# Altium project Control_unit-RM.PrjPcb
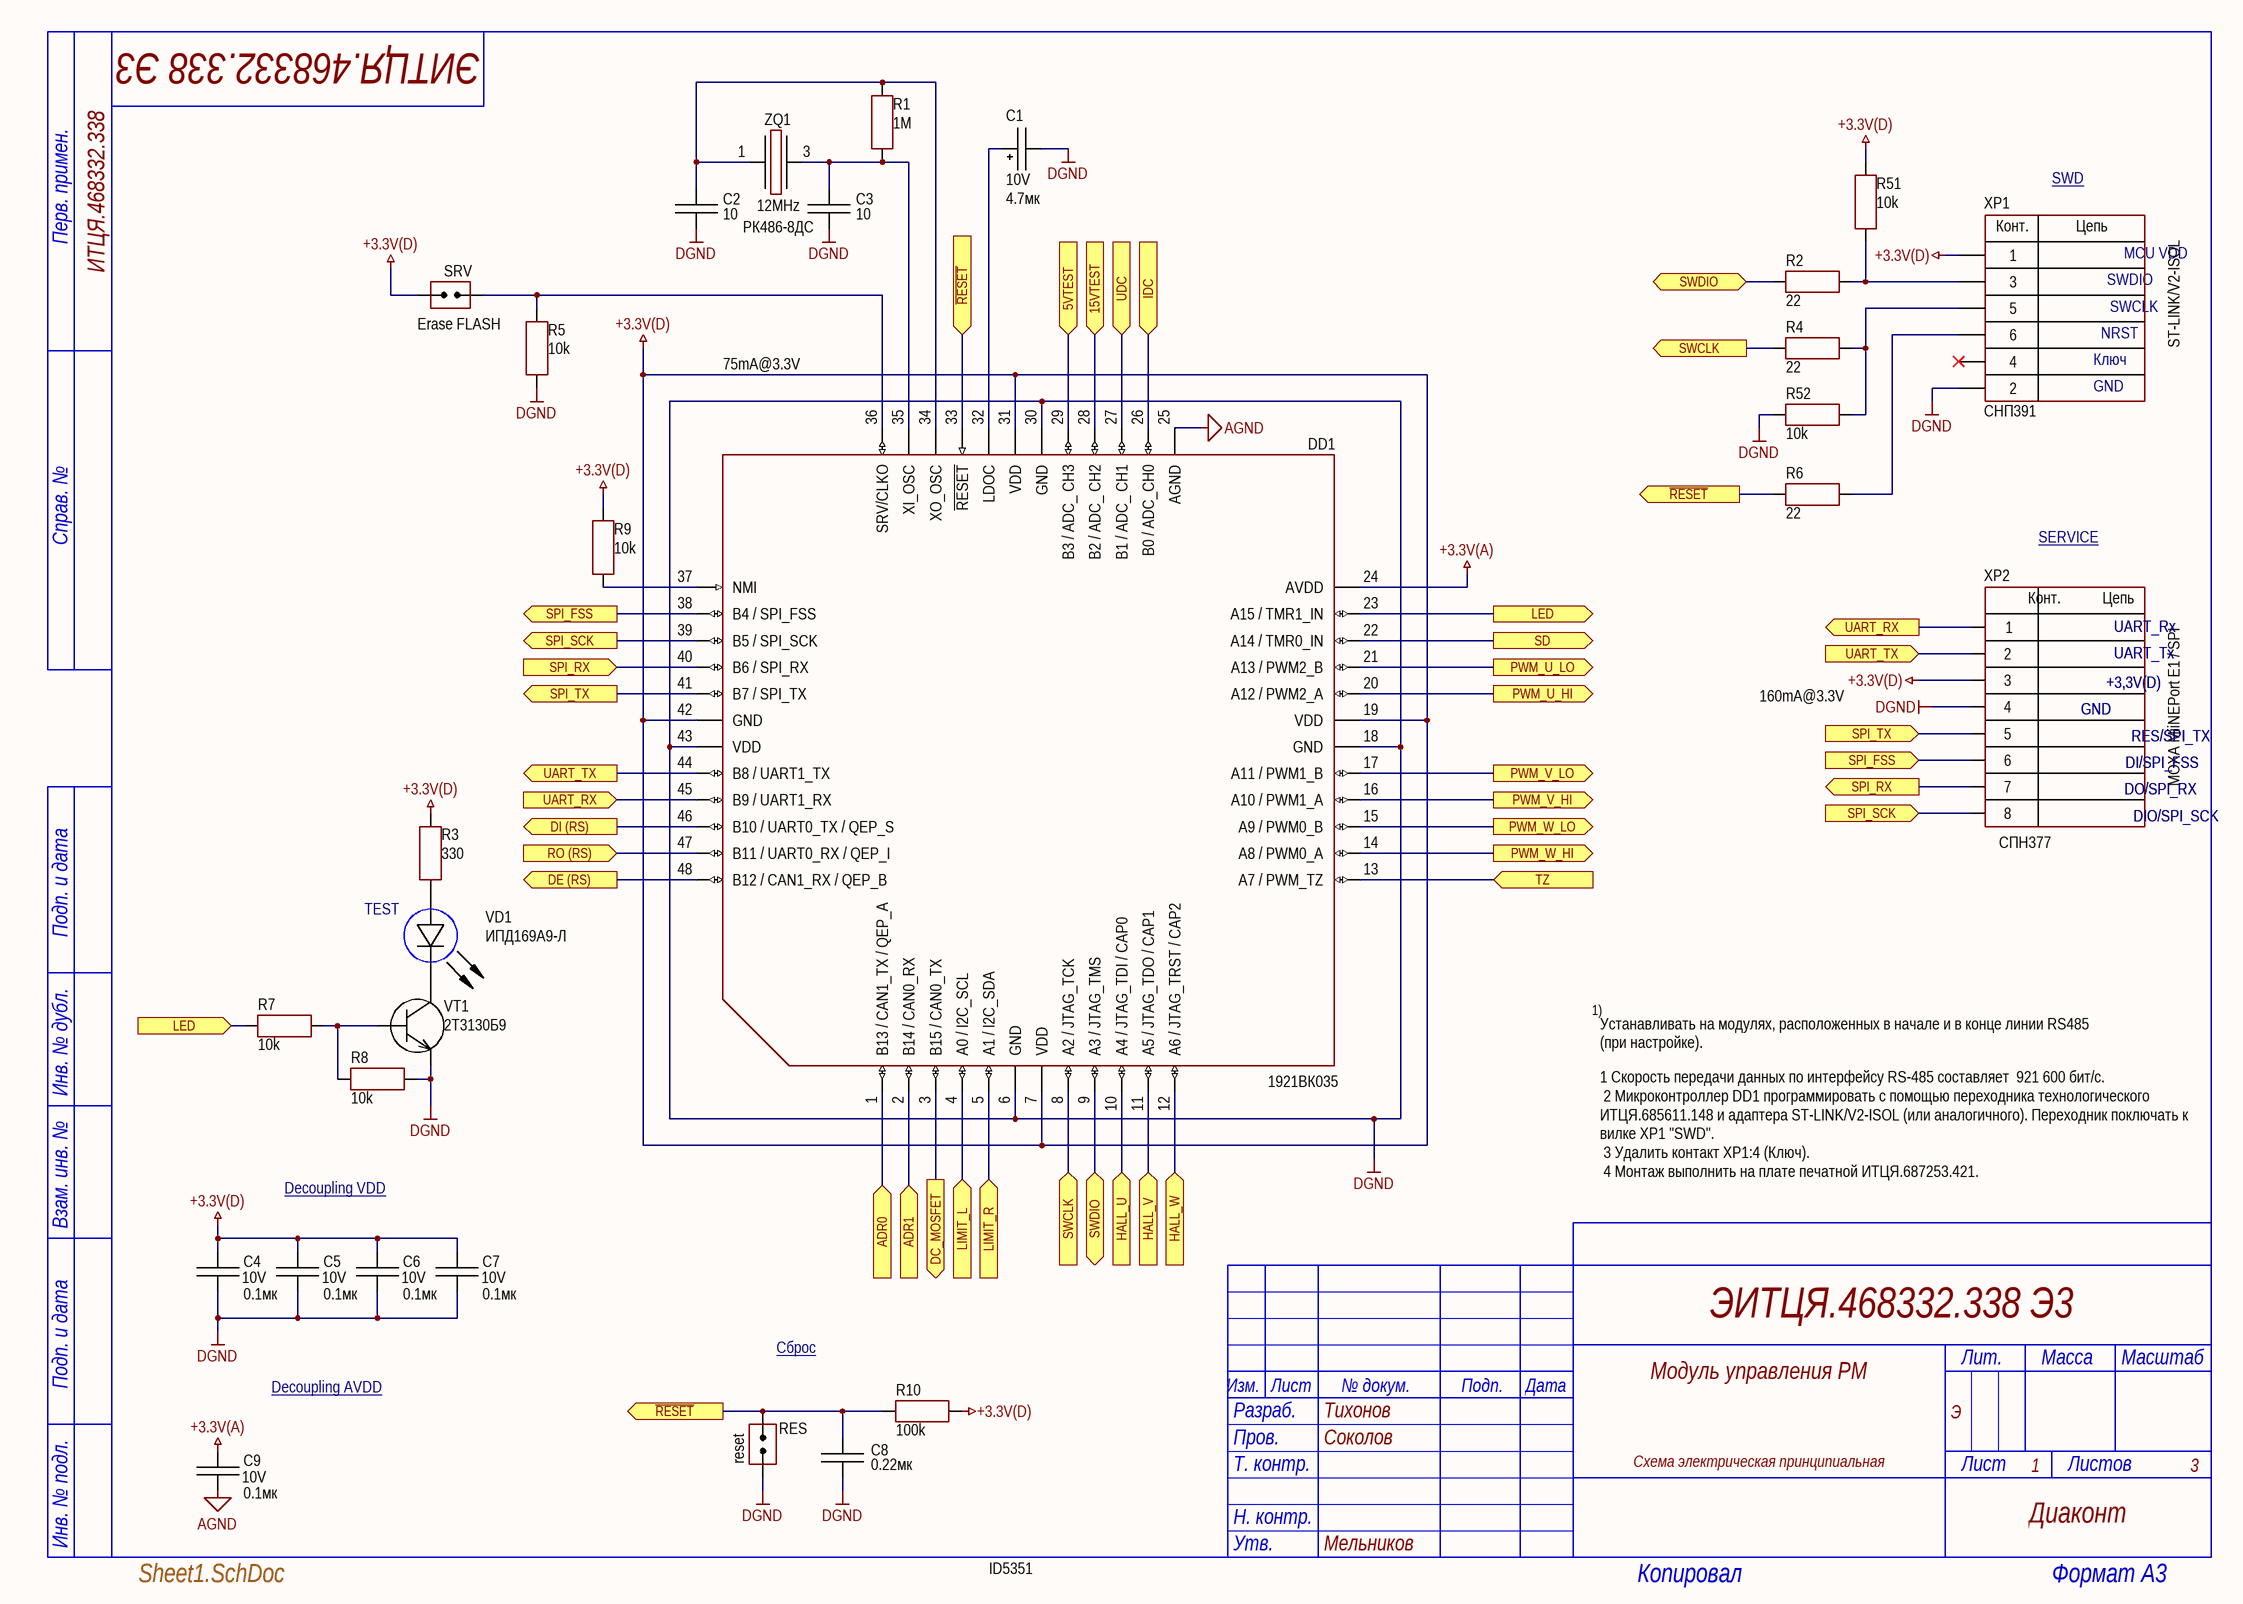
[diagram p0: Sheet1.SchDoc]
3 sheets, 113 parts. Net scope: flat (ports and power ports of the same name join across sheets).
Board file: PCB_control_unit.PcbDoc
Sheets:
  Sheet1.SchDoc
  Sheet2.SchDoc
  Sheet3.SchDoc

## Sheet Sheet1.SchDoc
size 420 x 297 mm; Language: en; ResponsibleDept: DED; DocumentStatus: Released; DecimalNumber: {DecimalNumber}; ApprovedBy: Мельников; CheckedBy: Соколов; CompanyName: Диаконт; DrawnBy: Тихонов; DocumentNumber: ЭИТЦЯ.468332.338 Э3; SheetNumber: 1; SheetTotal: 3; Title0: Модуль управления РМ; DocumentType: Схема электрическая принципиальная; Liter: Э; PageSetup: Record=PageOptions|CenterHorizontal=True|CenterVertical=True|PrintScale=0.96|XCorrection=1.00|YCorrection=1.00|PrintKind=1|BorderSize=5000000|LeftOffset=0|BottomOffset=0|Orientation=2|PaperLength=1000|PaperWidth=1000|Scale=100|PaperSource=7|PrintQuality=-4|MediaType=1|DitherType=10|PaperKind=A3|PrintScaleMode=1; FirstApp: ИТЦЯ.468332.338

### Parts
C1  value 4.7мк  Voltage: 10V  [CAP: TANTAL-A]
C2  value 10  [CAP: 0603P]
C3  value 10  [CAP: 0603P]
C4  value 0.1мк  Voltage: 10V  [CAP: 0603P]
C5  value 0.1мк  Voltage: 10V  [CAP: 0603P]
C6  value 0.1мк  Voltage: 10V  [CAP: 0603P]
C7  value 0.1мк  Voltage: 10V  [CAP: 0603P]
C8  value 0.22мк  [CAP: 0805P]
C9  value 0.1мк  Voltage: 10V  [CAP: 0603P]
DD1  (no value)  [48-QLCC (МК 5162.48-1) - small pads]
R1  value 1М  [RES: 0603P]
R2  value 22  [RES: 0603P]
R3  value 330  [RES: 0603P]
R4  value 22  [RES: 0603P]
R5  value 10k  [RES: 0603P]
R6  value 22  [RES: 0603P]
R7  value 10k  [RES: 0603P]
R8  value 10k  [RES: 0603P]
R9  value 10k  [RES: 0603P]
R10  value 100k  [RES: 0603P]
R51  value 10k  [RES: 0603P]
R52  value 10k  [RES: 0603P]
RES  CommentText: reset  [CON: JUMPER x1]
SRV  CommentText: Erase FLASH  [CON: JUMPER x1]
VD1  PartNumber: ИПД169А9-Л  CommentText: TEST  [LED: 0603G]
VT1  PartNumber: 2Т3130Б9  [SOT23]
XP1  CommentText: СНП391  [CON: PLLD-6-S]  (hidden comment: SWD)
XP2  CommentText: СПН377  [CON: PLD2-8-S]  (hidden comment: SERVICE)
ZQ1  Frequency: 12MHz  CommentPart: РК486-8ДС  [OSC: 5070G]

### Ports
5VTEST (in), 15VTEST (in), ADR0 (in), ADR1 (in), DC_MOSFET (out), DE (RS) (out), DI (RS) (out), HALL_U (in), HALL_V (in), HALL_W (in), IDC (in), LED (in), LED (out), LIMIT_L (in), LIMIT_R (in), PWM_U_HI (out), PWM_U_LO (out), PWM_V_HI (out), PWM_V_LO (out), PWM_W_HI (out), PWM_W_LO (out), RO (RS) (in), SD (out), SPI_FSS (in), SPI_FSS (out), SPI_RX (in), SPI_RX (out), SPI_SCK (in), SPI_SCK (out), SPI_TX (in), SPI_TX (out), SWCLK (in), SWCLK (out), SWDIO (bidir), TZ (in), UART_RX (in), UART_RX (out), UART_TX (in), UART_TX (out), UDC (in), ~{RESET} (in), ~{RESET} (out)

### Nets
+3.3V(A): C9.2 DD1.24(AVDD)
+3.3V(D): C4.2 C5.2 C6.2 C7.2 DD1.7(VDD) DD1.19(VDD) DD1.31(VDD) DD1.42(GND) R3.1 R9.1 R10.2 R51.1 SRV.1(IN) XP1.1 XP2.3
AGND: C9.1 DD1.25(AGND)
DGND: C1.2 C2.2 C3.2 C4.1 C5.1 C6.1 C7.1 C8.1 DD1.6(GND) DD1.18(GND) DD1.30(GND) DD1.43(VDD) R5.2 R8.1 R52.1 RES.1(IN) VT1.2(E) XP1.2 XP2.4
5VTEST: DD1.29(B3_/_ADC__CH3) ; port 5VTEST
15VTEST: DD1.28(B2_/_ADC__CH2) ; port 15VTEST
~{RESET}: C8.2 DD1.33(~{RESET}) R6.1 R10.1 RES.2(IN) ; port ~{RESET}
ADR0: DD1.1(B13_/_CAN1_TX_/_QEP_A) ; port ADR0
ADR1: DD1.2(B14_/_CAN0_RX) ; port ADR1
DC_MOSFET: DD1.3(B15_/_CAN0_TX) ; port DC_MOSFET
DE (RS): DD1.48(B12_/_CAN1_RX_/_QEP_B) ; port DE (RS)
DI (RS): DD1.46(B10_/_UART0_TX_/_QEP_S) ; port DI (RS)
HALL_U: DD1.10(A4_/_JTAG_TDI_/_CAP0) ; port HALL_U
HALL_V: DD1.11(A5_/_JTAG_TDO_/_CAP1) ; port HALL_V
HALL_W: DD1.12(A6_/_JTAG_TRST_/_CAP2) ; port HALL_W
IDC: DD1.26(B0_/_ADC_CH0) ; port IDC
LED: DD1.23(A15_/_TMR1_IN) R7.2 ; port LED
LIMIT_L: DD1.4(A0_/_I2C_SCL) ; port LIMIT_L
LIMIT_R: DD1.5(A1_/_I2C_SDA) ; port LIMIT_R
PWM_U_HI: DD1.20(A12_/_PWM2_A) ; port PWM_U_HI
PWM_U_LO: DD1.21(A13_/_PWM2_B) ; port PWM_U_LO
PWM_V_HI: DD1.16(A10_/_PWM1_A) ; port PWM_V_HI
PWM_V_LO: DD1.17(A11_/_PWM1_B) ; port PWM_V_LO
PWM_W_HI: DD1.14(A8_/_PWM0_A) ; port PWM_W_HI
PWM_W_LO: DD1.15(A9_/_PWM0_B) ; port PWM_W_LO
RO (RS): DD1.47(B11_/_UART0_RX_/_QEP_I) ; port RO (RS)
SD: DD1.22(A14_/_TMR0_IN) ; port SD
SPI_FSS: DD1.38(B4_/_SPI_FSS) XP2.6 ; port SPI_FSS
SPI_RX: DD1.40(B6_/_SPI_RX) XP2.7 ; port SPI_RX
SPI_SCK: DD1.39(B5_/_SPI_SCK) XP2.8 ; port SPI_SCK
SPI_TX: DD1.41(B7_/_SPI_TX) XP2.5 ; port SPI_TX
SWCLK: DD1.8(A2_/_JTAG_TCK) R4.1 ; port SWCLK
SWDIO: DD1.9(A3_/_JTAG_TMS) R2.1 ; port SWDIO
TZ: DD1.13(A7_/_PWM_TZ) ; port TZ
UART_RX: DD1.45(B9_/_UART1_RX) XP2.1 ; port UART_RX
UART_TX: DD1.44(B8_/_UART1_TX) XP2.2 ; port UART_TX
UDC: DD1.27(B1_/_ADC__CH1) ; port UDC
NetC1_1: C1.1 DD1.32(LDOC)
NetC2_1: C2.1 DD1.34(XO_OSC) R1.2 ZQ1.1
NetC3_1: C3.1 DD1.35(XI_OSC) R1.1 ZQ1.3
NetDD1_36: DD1.36(SRV/CLKO) R5.1 SRV.2(IN)
NetDD1_37: DD1.37(NMI) R9.2
NetR2_2: R2.2 R51.2 XP1.3
NetR3_2: R3.2 VD1.1(A)
NetR4_2: R4.2 R52.2 XP1.5
NetR6_2: R6.2 XP1.6
NetR7_1: R7.1 R8.2 VT1.1(B)
NetVD1_2: VD1.2(C) VT1.3(C)

Not connected (* = marked no-connect by the designer): XP1 4*

### Notes on the sheet
- SWD
- MCU VDD
- SWDIO
- SWCLK
- 75mA@3.3V
- Ключ
- GND
- NRST
- ST-LINK/V2-ISOL
- SERVICE
- UART_Rx
- UART_Tx
- 160mA@3.3V
- (near XP2) +3,3V(D)
- DO/SPI_RX
- DI/SPI_FSS
- RES/SPI_TX
- MOXA MiiNEPort E1 / SPI
- DIO/SPI_SCK
- 1)
- Устанавливать на модулях, расположенных в начале и в конце линии RS485 (при настройке).
- Decoupling VDD
- 1 Скорость передачи данных по интерфейсу RS-485 составляет  921 600 бит/с.
  2 Микроконтроллер DD1 программировать с помощью переходника технологического ИТЦЯ.685611.148 и адаптера ST-LINK/V2-ISOL (или аналогичного). Переходник поключать к вилке XP1 "SWD".
  3 Удалить контакт XP1:4 (Ключ).
  4 Монтаж выполнить на плате печатной ИТЦЯ.687253.421.
- Decoupling AVDD
- Сброс
- ID5351
- Перв. примен.
- Справ. №
- Подп. и дата
- Инв. № дубл.
- Взам. инв. №
- Изм.
- Лист
- № докум.
- Подп.
- Дата
- Лит.
- Масса
- Масштаб
- Разраб.
- Пров.
- Т. контр.
- Листов
- Инв. № подл.
- Н. контр.
- Утв.
- Копировал
- Формат A3
- (in symbol PLD2-8-S) Конт.; Цепь
- (in symbol PLLD1.27-6_1) Конт.; Цепь

### Library data of the parts
C1 = Tantal_A: Manufacturer: Элеконд; PartNumber: К53-68 "А"-10 В-4.7 мкф; ValueManufacturerPartNumber: Tantalum capacitor, 4.7мк, 10V, ±10%, 2Ohm, case A (3216), -55...+125°C; Impedance: 2Ohm; Tolerance: ±10%; TypeDielectric: X7R; TypeCapacitor: Tantalum capacitor; MAX: 00130629; Package: case A (3216); HelpURL: https://www.digikey.com/product-detail/en/avx-corporation/F930J107KAAAJ6/478-12404-1-ND/9645231; Temperature: -55...+125°C
C2 C3 = Ceramic_0603: Manufacturer: Монолит; PartNumber: К10-84в-1608М-50В-10 пФ ±5%-МП0-N-A; ValueManufacturerPartNumber: Ceramic capacitor, 10, МП0, ±5%, 50V, 0603, -55...+125°C; TypeCapacitor: Ceramic capacitor; Tolerance: ±5%; TypeDielectric: МП0; Voltage: 50V; Analog: 00133079 (pin-to-pin); Package: 0603; Temperature: -55...+125°C
C4-C7 C9 = Ceramic_0603: Manufacturer: Гириконд; PartNumber: К10-79-10В-0,1 мкФ +80-20% H90; ValueManufacturerPartNumber: Ceramic capacitor, 0.1мк, H90, +80-20%, 10V, 0603, -55...+125°C; TypeCapacitor: Ceramic capacitor; Tolerance: +80-20%; TypeDielectric: H90; MAX: 00131675; Package: 0603; HelpURL: http://www.giricond.ru/files/k10-79_vp_2018_saiyt.pdf; Temperature: -55...+125°C
C8 = Ceramic_5750M: Manufacturer: Монолит; PartNumber: К10-84в-1608М-25В-220 нФ +80/-20%-Н90-N-A; ValueManufacturerPartNumber: Ceramic capacitor, 0.22мк, H90, +80/-20%, 25V, 0805 (2012M), -55...+125°C; TypeCapacitor: Ceramic capacitor; Tolerance: +80/-20%; TypeDielectric: H90; Voltage: 25V; Analog: MAX 00131682 (pin-to-pin); Package: 0805 (2012M); Temperature: -55...+125°C
DD1 = 1921ВК035: Cortex-M4F; Manufacturer: НИИЭТ; ValueManufacturerPartNumber: Motor control microcontroller, 32-Bit, RISC, 100MHz, 64KB, 16KB, 3,3 В ± 10 %., -60...+85°C, 48-QLCC (МК 5162.48-1); Supply: 3,3 В ± 10 %.; Speed: 100MHz; CoreSize: 32-Bit; MemoryROM: 64KB; MemoryRAM: 16KB; CoreProcessor: RISC; HelpURL: https://niiet.ru/goods/tranzmod/newtr; Package: 48-QLCC (МК 5162.48-1); ComponentType: Motor control microcontroller; Temperature: -60...+85°C; PartNumber: 1921ВК035
R1 = Resistor_0603: Manufacturer: ОАО Ресурс; PartNumber: Р1-12-0,1ум.-1~МОм ±5%-М ШКАБ.434110.002 ТУ; ValueManufacturerPartNumber: Resistor film, 1М, ±5%, 0603, 0.1W, -55...+125°C; TypeResistor: Resistor film; Power: 0.1W; Tolerance: ±5%; MAX: 00133970; Package: 0603; HelpURL: https://aoresurs.com/catalog/chip_rezistory/rezistory-r1-12-kategoriya-kachestva-vp-/; Temperature: -55...+125°C
R2 R4 R6 = Resistor_0603: Manufacturer: ОАО Ресурс; PartNumber: Р1-12-0,1ум.-22~Ом ±5%-М ШКАБ.434110.002 ТУ; ValueManufacturerPartNumber: Resistor film, 22, ±5%, 0603, 0.1W, -55...+125°C; TypeResistor: Resistor film; Power: 0.1W; Tolerance: ±5%; MAX: 00134024; Package: 0603; HelpURL: https://aoresurs.com/catalog/chip_rezistory/rezistory-r1-12-kategoriya-kachestva-vp-/; Temperature: -55...+125°C
R3 = Resistor_0603: Manufacturer: ОАО Ресурс; PartNumber: Р1-12-0,1ум.-330~Ом ±5%-М ШКАБ.434110.002 ТУ; ValueManufacturerPartNumber: Resistor film, 330, ±5%, 0603, 0.1W, -55...+125°C; TypeResistor: Resistor film; Power: 0.1W; Tolerance: ±5%; MAX: 00134047; Package: 0603; HelpURL: https://aoresurs.com/catalog/chip_rezistory/rezistory-r1-12-kategoriya-kachestva-vp-/; Temperature: -55...+125°C
R5 R7-R9 R51 R52 = Resistor_0603: Manufacturer: ОАО Ресурс; PartNumber: Р1-12-0,1ум.-10~кОм ±5%-М ШКАБ.434110.002 ТУ; ValueManufacturerPartNumber: Resistor film, 10k, ±5%, 0603, 0.1W, -55...+125°C; TypeResistor: Resistor film; Power: 0.1W; Tolerance: ±5%; MAX: 00133985; Analog: MAX 00133985; Package: 0603; HelpURL: https://aoresurs.com/catalog/chip_rezistory/rezistory-r1-12-kategoriya-kachestva-vp-/; Temperature: -55...+125°C
R10 = Resistor_0603: Manufacturer: ОАО Ресурс; PartNumber: Р1-12-0,1ум.-100~кОм ±5%-М ШКАБ.434110.002 ТУ; ValueManufacturerPartNumber: Resistor film, 100k, ±5%, 0603, 0.1W, -55...+125°C; TypeResistor: Resistor film; Power: 0.1W; Tolerance: ±5%; MAX: 00133990; Analog: MAX 00122851; Package: 0603; HelpURL: https://aoresurs.com/catalog/chip_rezistory/rezistory-r1-12-kategoriya-kachestva-vp-/; Temperature: -55...+125°C
RES = Jumper_single: PartNumber: СНП377-2ВП21-1-02-04; Manufacturer: ОАО "Карачевский завод "Электродеталь"; MAX: 00124338; Pitch: 2mm; Analog: MAX 00148900 (PLS2-2); HelpURL: http://www.elektrodetal.com/product/soediniteli-dlya-pechatnyh-plat/snp377.html; Type: штыри 2 пина в отв.
SRV = Jumper_single: PartNumber: СНП391-2ВП21-1 РЮМК.430420.036 ТУ; Manufacturer: ОАО "Карачевский завод "Электродеталь"; Pitch: 1.27mm; Analog: PLL1.27 (MAX 00150250 с доработкой до 2 пинов); HelpURL: http://www.elektrodetal.com/product/soediniteli-dlya-pechatnyh-plat/snp377.html; Type: штыри 2 пина в отв.
VD1 = LED_single: Manufacturer: Протон; ValueManufacturerPartNumber: LED, 20mA max, 2.1V typ, 1608, -55...+150°C; TypeDiode: LED; Current: 20mA max; VoltageDrop: 2.1V typ; Color: GREEN; Analog: MAX 00129484 КР-1608 Kingbright (pin-to-pin); Package: 1608; HelpURL: *; Temperature: -55...+150°C
VT1 = BJT_NPN_132: Manufacturer: ООО НПК Далекс; ValueManufacturerPartNumber: NPN transistor, 30V, 100mA, , 300mW, 0.7V, 500, SOT-23 (КТ-46), -55...+125°C; TypeTransistor: NPN transistor; VoltageCE: 30V; CurrentCE: 100mA; VoltageSaturation: 0.7V; CurrentGain: 500; MaxPower: 300mW; MAX: 00123842; Package: SOT-23 (КТ-46); HelpURL: http://www.radioman-portal.ru/sprav/pp/transisters/sourse/2t3130.pdf; Temperature: -55...+125°C
XP1 = PLLD1.27-6_1: аналог СНП391-6ВП41-2; Manufacturer: Электроделать; ValueManufacturerPartNumber: Connector, 6pin, 1.27mm, 125VAC, 1A; PartNumber: СНП391-6ВП41-2 РЮМК.430420.036 ТУ; TypeConnector: Connector; VoltageMax: 125VAC; Pitch: 1.27mm; CurrentMax: 1A; Multichannel: 6pin; Analog: MAX 00130684 c доработкой до 6 пинов; HelpURL: https://www.elektrodetal.com/catalog/snp391/; Analog 1: PLLD1.27-6
XP2 = PLD2-8-S: СНП377-8ВП41-2 SMD; Manufacturer: ОАО "Карачевский завод "Электродеталь"; TU: РЮМК.430420.017 ТУ; Pitch: 2mm; Value: *; RefDes/Designator: *; Pattern/Footprint: *; Type: Вилка; HelpURL: https://www.elektrodetal.com/catalog/snp377/; Analog: PLD2-8-S; PartNumber: СНП377-8ВП41-2
ZQ1 = Oscilator_5070: Manufacturer: ОАО "Морион"; PartNumber: РК486-8ДС-12000K; ValueManufacturerPartNumber: Oscilator, 12MHz, CMOS, ±30ppm, case 5070, -40...+85°C; LoadCapacitance: CMOS; Tolerance: ±30ppm; MAX: 00149842; Package: case 5070; HelpURL: http://www.lit-phonon.ru/downloads/RK486.pdf; Temperature: -40...+85°C; TypeOscilator: Oscilator

## Sheet Sheet2.SchDoc: {Title}
size 420 x 297 mm; Date: 2018-01-17; ApprovedBy: {ApprovedBy}; CheckedBy: {TechnicalReference}; Author: {CreatedBy}; CompanyName: Diakont; DocumentNumber: ЭИТЦЯ.468332.338 Э3; Revision: A; SheetNumber: 2; Title0: {Title0}; DocumentType: {DocumentType}; TechControl: {TechControl}; PageSetup: Record=PageOptions|CenterHorizontal=True|CenterVertical=True|PrintScale=0.96|XCorrection=1.00|YCorrection=1.00|PrintKind=1|BorderSize=5000000|LeftOffset=0|BottomOffset=0|Orientation=2|PaperLength=1000|PaperWidth=1000|Scale=100|PaperSource=7|PrintQuality=-4|MediaType=1|DitherType=10|PaperKind=A3|PrintScaleMode=1; Language: en; ResponsibleDept: DED; DocumentStatus: Released; DecimalNumber: ЭИТЦЯ.468332.338 Э3
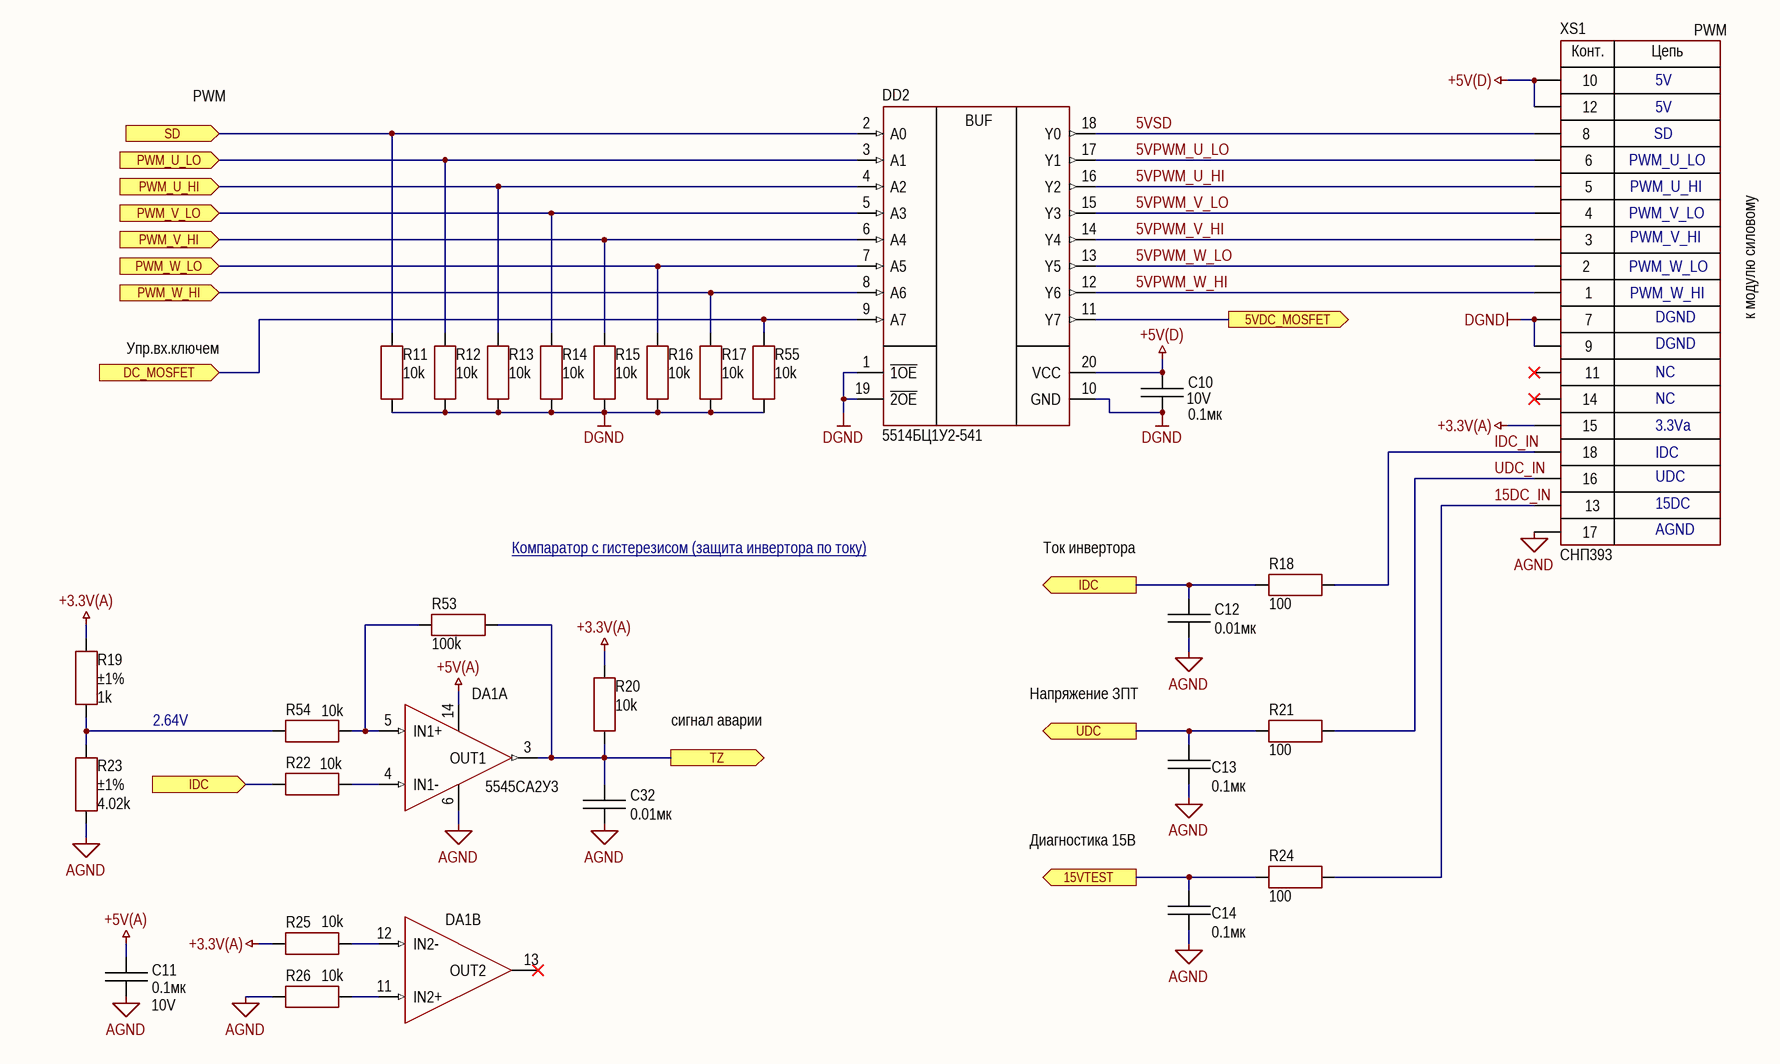
[diagram p1: Sheet2.SchDoc]

### Parts
C10  value 0.1мк  Voltage: 10V  [CAP: 0603P]
C11  value 0.1мк  Voltage: 10V  [CAP: 0603P]
C12  value 0.01мк  [CAP: 0603P]
C13  value 0.1мк  [CAP: 0603P]
C14  value 0.1мк  [CAP: 0603P]
C32  value 0.01мк  [CAP: 0603P]
DA1  (no value)  [16-Н04.16-1B]  (parts A,B of 2)
DD2  (no value)  [20-QLCC (5121.20-A)]
R11  value 10k  [RES: 0603P]
R12  value 10k  [RES: 0603P]
R13  value 10k  [RES: 0603P]
R14  value 10k  [RES: 0603P]
R15  value 10k  [RES: 0603P]
R16  value 10k  [RES: 0603P]
R17  value 10k  [RES: 0603P]
R18  value 100  [RES: 0603P]
R19  value 1k  Tolerance: ±1%  [RES: 0603P]
R20  value 10k  [RES: 0603P]
R21  value 100  [RES: 0603P]
R22  value 10k  [RES: 0603P]
R23  value 4.02k  Tolerance: ±1%  [RES: 0603P]
R24  value 100  [RES: 0603P]
R25  value 10k  [RES: 0603P]
R26  value 10k  [RES: 0603P]
R53  value 100k  [RES: 0603P]
R54  value 10k  [RES: 0603P]
R55  value 10k  [RES: 0603P]
XS1  CommentText: СНП393  [CON: PBD-18]

### Ports
5VDC_MOSFET (out), 15VTEST (out), DC_MOSFET (in), IDC (in), IDC (out), PWM_U_HI (in), PWM_U_LO (in), PWM_V_HI (in), PWM_V_LO (in), PWM_W_HI (in), PWM_W_LO (in), SD (in), TZ (out), UDC (out)

### Nets
+3.3V(A): R19.1 R20.1 R25.2 XS1.15
+5V(A): C11.2 DA1.14(V+)
+5V(D): C10.2 DD2.20(VCC) XS1.10 XS1.12
AGND: C11.1 C12.2 C13.1 C14.1 C32.2 DA1.6(V-) R23.2 R26.2 XS1.17
DGND: C10.1 DD2.1(~{1OE}) DD2.10(GND) DD2.19(~{2OE}) R11.2 R12.2 R13.2 R14.2 R15.2 R16.2 R17.2 R55.2 XS1.7 XS1.9
5VDC_MOSFET: DD2.11(Y7) ; port 5VDC_MOSFET
5VPWM_U_HI: DD2.16(Y2) XS1.5
5VPWM_U_LO: DD2.17(Y1) XS1.6
5VPWM_V_HI: DD2.14(Y4) XS1.3
5VPWM_V_LO: DD2.15(Y3) XS1.4
5VPWM_W_HI: DD2.12(Y6) XS1.1
5VPWM_W_LO: DD2.13(Y5) XS1.2
5VSD: DD2.18(Y0) XS1.8
15DC_IN: R24.1 XS1.13
15VTEST: C14.2 R24.2 ; port 15VTEST
DC_MOSFET: DD2.9(A7) R55.1 ; port DC_MOSFET
IDC: C12.1 R18.2 R22.1 ; port IDC
IDC_IN: R18.1 XS1.18
PWM_U_HI: DD2.4(A2) R13.1 ; port PWM_U_HI
PWM_U_LO: DD2.3(A1) R12.1 ; port PWM_U_LO
PWM_V_HI: DD2.6(A4) R15.1 ; port PWM_V_HI
PWM_V_LO: DD2.5(A3) R14.1 ; port PWM_V_LO
PWM_W_HI: DD2.8(A6) R17.1 ; port PWM_W_HI
PWM_W_LO: DD2.7(A5) R16.1 ; port PWM_W_LO
SD: DD2.2(A0) R11.1 ; port SD
TZ: C32.1 DA1.3(OUT1) R20.2 R53.2 ; port TZ
UDC: C13.2 R21.2 ; port UDC
UDC_IN: R21.1 XS1.16
NetDA1_4: DA1.4(IN1-) R22.2
NetDA1_5: DA1.5(IN1+) R53.1 R54.2
NetDA1_11: DA1.11(IN2+) R26.1
NetDA1_12: DA1.12(IN2-) R25.1
NetR19_2: R19.2 R23.1 R54.1

Not connected (* = marked no-connect by the designer): DA1 13(OUT2)*; XS1 11* 14*

### Notes on the sheet
- 5V
- PWM
- SD
- PWM_U_LO
- PWM_V_LO
- PWM_U_HI
- PWM_W_LO
- PWM_V_HI
- Упр.вх.ключем
- PWM_W_HI
- DGND
- к модулю силовому
- NC
- 3.3Va
- IDC
- UDC
- Компаратор c гистерезисом (защита инвертора по току)
- Ток инвертора
- 15DC
- AGND
- 2.64V
- сигнал аварии
- Напряжение ЗПТ
- Диагностика 15В
- Подп. и дата
- Инв. № дубл.
- Взам. инв. №
- Инв. № подл.
- Лист
- Изм.
- № докум.
- Подп.
- Дата
- Копировал
- Формат A3
- (in symbol 5514БЦ1У2-541) BUF
- (in symbol PBD-18) Конт.; Цепь

### Library data of the parts
C10 C11 = Ceramic_0603: as C4 on sheet Sheet1; Package: 0603; HelpURL: http://www.giricond.ru/files/k10-79_vp_2018_saiyt.pdf; Temperature: -55...+125°C
C12 C32 = Ceramic_0603: Manufacturer: Монолит; PartNumber: К10-84в-1608М-50В-0.01мк ±20%-Н20-N-A; ValueManufacturerPartNumber: Ceramic capacitor, 0.01мк, H20, ±20%, 50V, 0603, -55...+125°C; TypeCapacitor: Ceramic capacitor; Tolerance: ±20%; TypeDielectric: H20; Voltage: 50V; Analog: MAX 00131676 (pin-to-pin); Package: 0603; HelpURL: http://www.monolit.vitebsk.by/Files/K10-84.pdf; Temperature: -55...+125°C
C13 C14 = Ceramic_0603: Manufacturer: Гириконд; PartNumber: К10-79-10В-0,1 мкФ +80-20% H90; ValueManufacturerPartNumber: Ceramic capacitor, 0.1мк, H90, +80-20%, 10V, 0603, -55...+125°C; TypeCapacitor: Ceramic capacitor; Tolerance: +80-20%; TypeDielectric: H90; Voltage: 10V; MAX: 00131675; Package: 0603; HelpURL: http://www.giricond.ru/files/k10-79_vp_2018_saiyt.pdf; Temperature: -55...+125°C
DA1 = 5545СА2У3: Comparator USSR; Manufacturer: НПП ВОСТОК; ValueManufacturerPartNumber: IC comparator, Open Drain, от ± 1,5В до ± 16,5В, -60...+125°C, Н04.16-1В; Supply: от ± 1,5В до ± 16,5В; OutputType: Open Drain; Analog: LM2903D; TY: АЕЯР.431350.632-02 ТУ; HelpURL: http://www.vostok.nsk.su/files/pdf/152181836987_5545ca2u3.pdf; Package: Н04.16-1В; ComponentType: IC comparator; Temperature: -60...+125°C; PartNumber: 5545СА2У3
DD2 = 5514БЦ1У2-541: USSR Buffer QFN; Manufacturer: Анстрем; ValueManufacturerPartNumber: 8 канальный буфер, 4.5..5.5V, -60...+125°C, 5121.20-A; Supply: 4.5..5.5V; Analog: функц.-й аналог 74(54)HC 541; Package: 5121.20-A; ComponentType: 8 канальный буфер; Temperature: -60...+125°C; PartNumber: 5514БЦ1У2-541
R11-R17 R20 R22 R25 R26 R54 R55 = Resistor_0603: Manufacturer: ОАО Ресурс; PartNumber: Р1-12-0,1ум.-10~кОм ±5%-М ШКАБ.434110.002 ТУ; ValueManufacturerPartNumber: Resistor film, 10k, ±5%, 0603, 0.1W, -55...+125°C; TypeResistor: Resistor film; Power: 0.1W; Tolerance: ±5%; MAX: 00133985; Analog: MAX 00133986 (1%); Package: 0603; HelpURL: https://aoresurs.com/catalog/chip_rezistory/rezistory-r1-12-kategoriya-kachestva-vp-/; Temperature: -55...+125°C
R18 R21 R24 = Resistor_0603: Manufacturer: ОАО Ресурс; PartNumber: Р1-12-0,1ум.-100~Ом ±5%-М ШКАБ.434110.002 ТУ; ValueManufacturerPartNumber: Resistor film, 100, ±5%, 0603, 0.1W, -55...+125°C; TypeResistor: Resistor film; Power: 0.1W; Tolerance: ±5%; MAX: 00133991; Package: 0603; HelpURL: https://aoresurs.com/catalog/chip_rezistory/rezistory-r1-12-kategoriya-kachestva-vp-/; Temperature: -55...+125°C
R19 = Resistor_0603: Manufacturer: ОАО Ресурс; PartNumber: Р1-12-0,1ум.-1~кОм ±1%-М ШКАБ.434110.002 ТУ; ValueManufacturerPartNumber: Resistor film, 1k, ±1%, 0603, 0.1W, -55...+125°C; TypeResistor: Resistor film; Power: 0.1W; MAX: 00133971; Package: 0603; HelpURL: https://aoresurs.com/catalog/chip_rezistory/rezistory-r1-12-kategoriya-kachestva-vp-/; Temperature: -55...+125°C
R23 = Resistor_0603: Manufacturer: ОАО Ресурс; PartNumber: Р1-12-0,1ум.-4.02~кОм ±1%-М ШКАБ.434110.002 ТУ; ValueManufacturerPartNumber: Resistor film, 4.02k, ±1%, 0603, 0.1W, -55...+125°C; TypeResistor: Resistor film; Power: 0.1W; MAX: 00134054; Package: 0603; HelpURL: https://aoresurs.com/catalog/chip_rezistory/rezistory-r1-12-kategoriya-kachestva-vp-/; Temperature: -55...+125°C
R53 = Resistor_0603: as R10 on sheet Sheet1; Package: 0603; HelpURL: https://aoresurs.com/catalog/chip_rezistory/rezistory-r1-12-kategoriya-kachestva-vp-/; Temperature: -55...+125°C
XS1 = PBD-18: Manufacturer: Электродеталь; ValueManufacturerPartNumber: Connector, 18pin, 2.54mm, 500VAC, 3A; PartNumber: СНП393-18РП21-2 РЮМК.430420.035 ТУ; TypeConnector: Connector; VoltageMax: 500VAC; Pitch: 2.54mm; CurrentMax: 3A; Multichannel: 18pin; Analog: MAX 00135030 с доработкой до 18-pin; HelpURL: https://www.elektrodetal.com/catalog/snp393/

## Sheet Sheet3.SchDoc: {Title}
size 420 x 297 mm; Date: 2018-01-17; ApprovedBy: {ApprovedBy}; CheckedBy: {TechnicalReference}; Author: {CreatedBy}; CompanyName: Diakont; DocumentNumber: ЭИТЦЯ.468332.338 Э3; Revision: A; SheetNumber: 3; Title0: {Title0}; DocumentType: {DocumentType}; TechControl: {TechControl}; PageSetup: Record=PageOptions|CenterHorizontal=True|CenterVertical=True|PrintScale=0.96|XCorrection=1.00|YCorrection=1.00|PrintKind=1|BorderSize=5000000|LeftOffset=0|BottomOffset=0|Orientation=2|PaperLength=1000|PaperWidth=1000|Scale=100|PaperSource=7|PrintQuality=-4|MediaType=1|DitherType=10|PaperKind=A3|PrintScaleMode=1; Language: en; ResponsibleDept: DED; DocumentStatus: Released; DecimalNumber: ЭИТЦЯ.468332.338 Э3
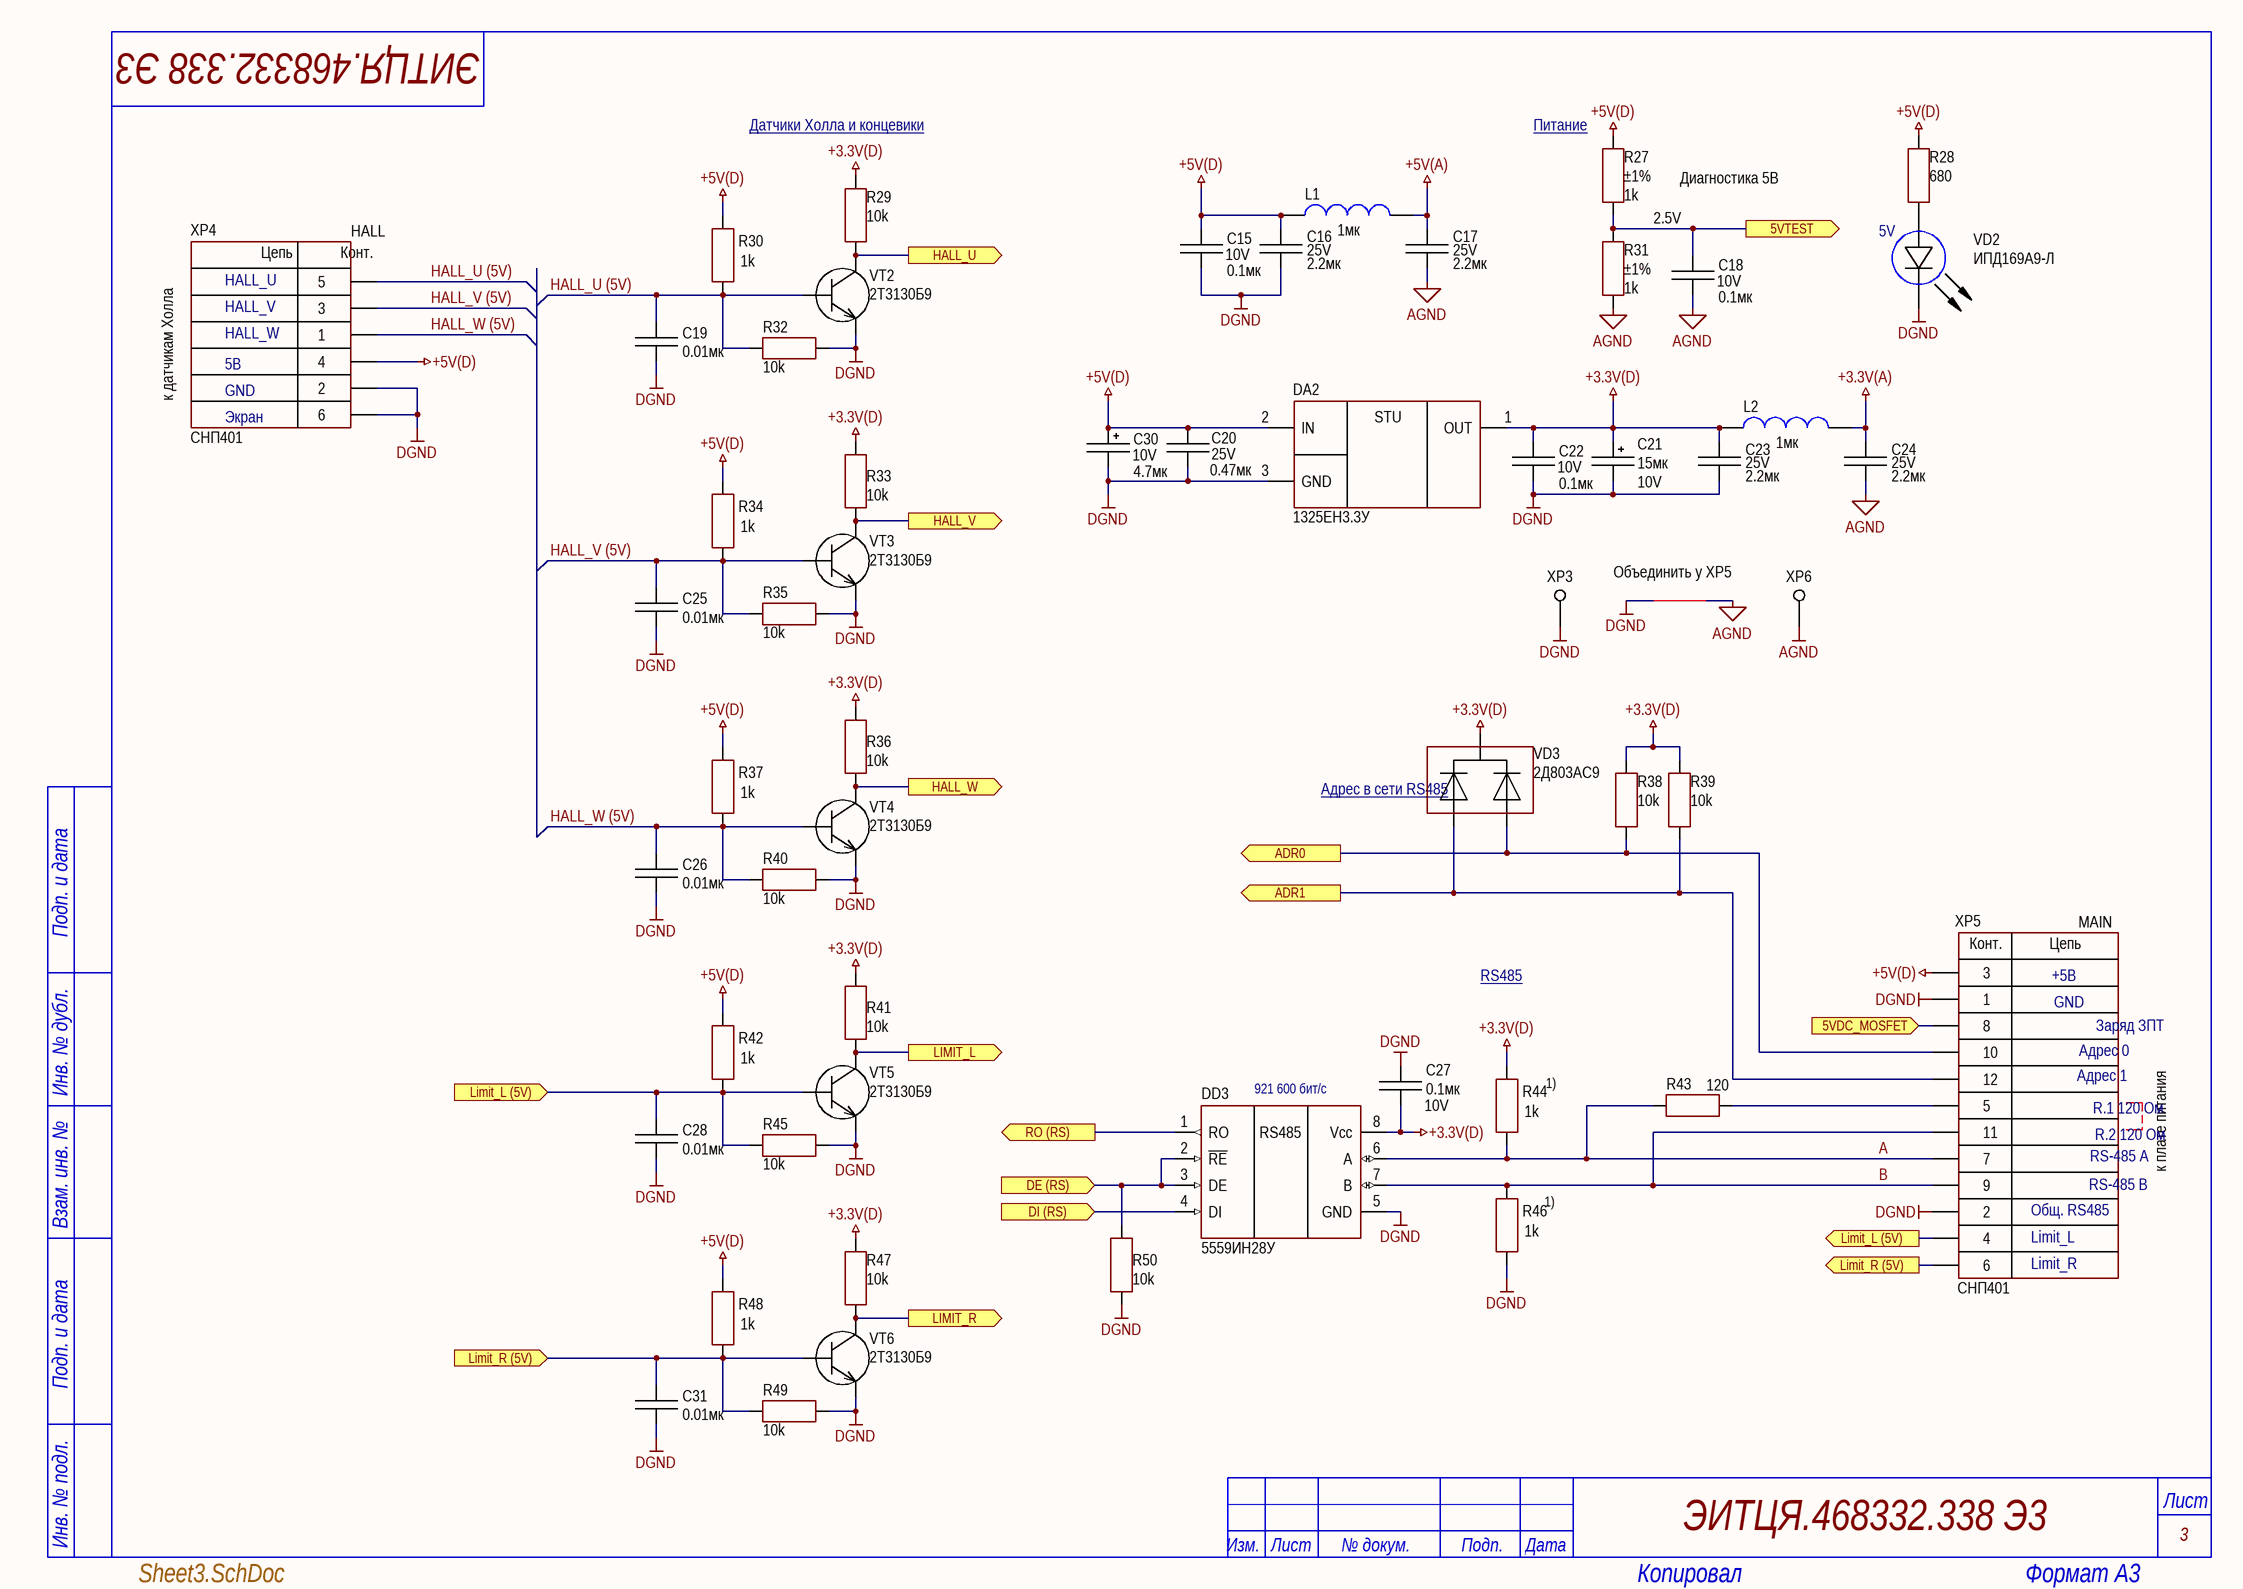
[diagram p2: Sheet3.SchDoc]

### Parts
C15  value 0.1мк  Voltage: 10V  [CAP: 0603P]
C16  value 2.2мк  Voltage: 25V  [CAP: 1210]  (hidden comment: Ceramic capacitor, 4.7мк, H90, +80 -20%, 25V, 1812 (4532М) (4.5x3.2), -55...+125°C)
C17  value 2.2мк  Voltage: 25V  [CAP: 1210]  (hidden comment: Ceramic capacitor, 4.7мк, H90, +80 -20%, 25V, 1812 (4532М) (4.5x3.2), -55...+125°C)
C18  value 0.1мк  Voltage: 10V  [CAP: 0603P]
C19  value 0.01мк  [CAP: 0603P]
C20  value 0.47мк  Voltage: 25V  [CAP: 1210]
C21  value 15мк  Voltage: 10V  [CAP: TANTAL-B]
C22  value 0.1мк  Voltage: 10V  [CAP: 0603P]
C23  value 2.2мк  Voltage: 25V  [CAP: 1210]  (hidden comment: Ceramic capacitor, 4.7мк, H90, +80 -20%, 25V, 1812 (4532М) (4.5x3.2), -55...+125°C)
C24  value 2.2мк  Voltage: 25V  [CAP: 1210]  (hidden comment: Ceramic capacitor, 4.7мк, H90, +80 -20%, 25V, 1812 (4532М) (4.5x3.2), -55...+125°C)
C25  value 0.01мк  [CAP: 0603P]
C26  value 0.01мк  [CAP: 0603P]
C27  value 0.1мк  Voltage: 10V  [CAP: 0603P]
C28  value 0.01мк  [CAP: 0603P]
C30  value 4.7мк  Voltage: 10V  [CAP: TANTAL-A]
C31  value 0.01мк  [CAP: 0603P]
DA2  PartNumber: 1325ЕН3.3У  [KT-93-1]
DD3  5559ИН28У  [Н02.8-1В]
L1  value 1мк  [IND: 0603]
L2  value 1мк  [IND: 0603]
NT1  (no value)  [NetTie_0603]  (net tie, no BOM)
R27  value 1k  Tolerance: ±1%  [RES: 0603P]
R28  value 680  [RES: 0603P]
R29  value 10k  [RES: 0603P]
R30  value 1k  [RES: 0603P]
R31  value 1k  Tolerance: ±1%  [RES: 0603P]
R32  value 10k  [RES: 0603P]
R33  value 10k  [RES: 0603P]
R34  value 1k  [RES: 0603P]
R35  value 10k  [RES: 0603P]
R36  value 10k  [RES: 0603P]
R37  value 1k  [RES: 0603P]
R38  value 10k  [RES: 0603P]
R39  value 10k  [RES: 0603P]
R40  value 10k  [RES: 0603P]
R41  value 10k  [RES: 0603P]
R42  value 1k  [RES: 0603P]
R43  value 120  [RES: 0805P]
R44  value 1k  [RES: 0603P]
R45  value 10k  [RES: 0603P]
R46  value 1k  [RES: 0603P]
R47  value 10k  [RES: 0603P]
R48  value 1k  [RES: 0603P]
R49  value 10k  [RES: 0603P]
R50  value 10k  [RES: 0603P]
VD2  PartNumber: ИПД169А9-Л  CommentText: 5V  [LED: 0603G]
VD3  PartNumber: 2Д803АС9  [SOT23]
VT2  PartNumber: 2Т3130Б9  [SOT23]
VT3  PartNumber: 2Т3130Б9  [SOT23]
VT4  PartNumber: 2Т3130Б9  [SOT23]
VT5  PartNumber: 2Т3130Б9  [SOT23]
VT6  PartNumber: 2Т3130Б9  [SOT23]
XP3  DGND  [CON: PLS2-1]  (value not drawn)
XP4  CommentText: СНП401  [CON: M80-5000605]
XP5  CommentText: СНП401  [CON: M80-5001205]
XP6  AGND  [CON: PLS2-1]  (value not drawn)

### Ports
5VDC_MOSFET (in), 5VTEST (out), ADR0 (out), ADR1 (out), DE (RS) (in), DI (RS) (in), HALL_U (out), HALL_V (out), HALL_W (out), Limit_L (5V) (in), Limit_L (5V) (out), LIMIT_L (out), Limit_R (5V) (in), Limit_R (5V) (out), LIMIT_R (out), RO (RS) (out)

### Nets
+3.3V(A): C24.2 L2.1
+3.3V(D): C21.1 C22.2 C23.2 C27.1 DA2.1(OUT) DD3.8(Vcc) L2.2 R29.1 R33.1 R36.1 R38.1 R39.1 R41.1 R44.1 R47.1 VD3.3
+5V(A): C17.2 L1.1
+5V(D): C15.2 C16.2 C20.2 C30.1 DA2.2(IN) L1.2 R27.1 R28.1 R30.1 R34.1 R37.1 R42.1 R48.1 XP4.4 XP5.3
AGND: C17.1 C18.1 C24.1 NT1.2 R31.2 XP6.1
DGND: C15.1 C16.1 C19.2 C20.1 C21.2 C22.1 C23.1 C25.2 C26.2 C27.2 C28.2 C30.2 C31.2 DA2.3(GND) DD3.5(GND) DD3.9(TP) NT1.1 R32.1 R35.1 R40.1 R45.1 R46.2 R49.1 R50.2 VD2.2(C) VT2.2(E) VT3.2(E) VT4.2(E) VT5.2(E) VT6.2(E) XP3.1 XP4.2 XP4.6 XP5.1 XP5.2
5VDC_MOSFET: XP5.8 ; port 5VDC_MOSFET
5VTEST: C18.2 R27.2 R31.1 ; port 5VTEST
A: DD3.6(A) R43.2 R44.2 XP5.7
ADR0: R38.2 VD3.2 XP5.10 ; port ADR0
ADR1: R39.2 VD3.1 XP5.12 ; port ADR1
B: DD3.7(B) R46.1 XP5.9 XP5.11
DE (RS): DD3.2(~{RE}) DD3.3(DE) R50.1 ; port DE (RS)
DI (RS): DD3.4(DI) ; port DI (RS)
HALL_U: R29.2 VT2.3(C) ; port HALL_U
HALL_U (5V): C19.1 R30.2 R32.2 VT2.1(B) XP4.5
HALL_V: R33.2 VT3.3(C) ; port HALL_V
HALL_V (5V): C25.1 R34.2 R35.2 VT3.1(B) XP4.3
HALL_W: R36.2 VT4.3(C) ; port HALL_W
HALL_W (5V): C26.1 R37.2 R40.2 VT4.1(B) XP4.1
LIMIT_L: R41.2 VT5.3(C) ; port LIMIT_L
Limit_L (5V): C28.1 R42.2 R45.2 VT5.1(B) XP5.4 ; port Limit_L (5V)
LIMIT_R: R47.2 VT6.3(C) ; port LIMIT_R
Limit_R (5V): C31.1 R48.2 R49.2 VT6.1(B) XP5.6 ; port Limit_R (5V)
RO (RS): DD3.1(RO) ; port RO (RS)
NetR28_2: R28.2 VD2.1(A)
NetR43_1: R43.1 XP5.5

### Notes on the sheet
- Датчики Холла и концевики
- Питание
- Диагностика 5В
- (near XP4) HALL
- 2.5V
- HALL_U
- HALL_V
- к датчикам Холла
- HALL_W
- 5В
- GND
- Экран
- (near NT1) Объединить у XP5
- Адрес в сети RS485
- MAIN
- RS485
- +5В
- Адрес 0
- Заряд ЗПТ
- (near DD3) 921 600 бит/с
- (near R44) 1)
- Адрес 1
- (near XP5) R.1 120 Ом
- (near R46) 1)
- RS-485 B
- RS-485 A
- (near XP5) R.2 120 Ом
- к плате питания
- Limit_L
- Limit_R
- Общ. RS485
- Подп. и дата
- Инв. № дубл.
- Взам. инв. №
- Инв. № подл.
- Лист
- Изм.
- № докум.
- Подп.
- Дата
- Копировал
- Формат A3
- (in symbol 1325ЕР1У) STU
- (in symbol 5559ИН28У) RS485
- (in symbol M80-5000605 Harwin) Цепь; Конт.
- (in symbol M80-5001205 Harwin) Конт.; Цепь

### Library data of the parts
C15 C18 C22 C27 = Ceramic_0603: Manufacturer: Гириконд; PartNumber: К10-79-10В-0,1 мкФ +80-20% H90; ValueManufacturerPartNumber: Ceramic capacitor, 0.1мк, H90, +80-20%, 10V, 0603, -55...+125°C; TypeCapacitor: Ceramic capacitor; Tolerance: +80-20%; TypeDielectric: H90; Package: 0603; HelpURL: http://www.giricond.ru/files/k10-79_vp_2018_saiyt.pdf; Temperature: -55...+125°C
C16 C17 C23 C24 = Ceramic_1210: Manufacturer: Монолит; PartNumber: К10-84в-3225М-25В-2,2 мкФ +80/-20%-Н90-N-A; Package: 1210 (3225М); HelpURL: https://www.digikey.com/product-detail/en/yageo/CC1210KKX7R9BB104/311-4522-1-ND/8025611; ValueManufacturerPartNumber: Ceramic capacitor, 4.7мк, H90, +80 -20%, 25V, 1812 (4532М) (4.5x3.2), -55...+125°C; Temperature: -55...+125°C; TypeCapacitor: Ceramic capacitor; Tolerance: +80 -20%; TypeDielectric: H90
C19 C25 C26 C28 C31 = Ceramic_0603: as C12 on sheet Sheet2; Package: 0603; HelpURL: http://www.monolit.vitebsk.by/Files/K10-84.pdf; Temperature: -55...+125°C
C20 = Ceramic_0603: Manufacturer: Монолит; PartNumber: К10-84в-3225М-25В-0,47 мкФ ±10%-Н20-N-A; ValueManufacturerPartNumber: Ceramic capacitor, 0.47мк, Н20, ±10%, 25V, 1210 (3225M),; TypeCapacitor: Ceramic capacitor; Tolerance: ±10%; TypeDielectric: Н20; Analog: MAX 00150226; Package: 1210 (3225M); HelpURL: http://www.monolit.vitebsk.by/Files/K10-84.pdf
C21 = Tantal_B: Manufacturer: "Элеконд"; PartNumber: К53-68 В-10 В-15 мкФ ±10%; ValueManufacturerPartNumber: Tantalum capacitor, 15мк, 10V, ±10%, , case B (3528), -55...+125°C; Tolerance: ±10%; TypeCapacitor: Tantalum capacitor; MAX: 00130628; Package: case B (3528); Temperature: -55...+125°C
C30 = Tantal_A: as C1 on sheet Sheet1; Package: case A (3216); HelpURL: https://www.digikey.com/product-detail/en/avx-corporation/F930J107KAAAJ6/478-12404-1-ND/9645231; Temperature: -55...+125°C
DA2 = 1325ЕР1У: Linear voltage regulator 3V3; Manufacturer: Интеграл; ValueManufacturerPartNumber: Linear voltage regulator, input 4.75...15V, 1.3V, output 3.3V, 0.8A, -40...+85°C, КТ-93-1; VoltageInput: input 4.75...15V; MaxDropout: 1.3V; CurrentOutput: 0.8A; VoltageOutput: output 3.3V; MAX: 00141284; HelpURL: https://www.integral.by/sites/default/files/pdf/specifikaciya_serii_1325.pdf; Package: КТ-93-1; ComponentType: Linear voltage regulator; Temperature: -40...+85°C
DD3 = 5559ИН28У: RS485 USSR; Manufacturer: Миландр; Supply: 3-5V; DataRate: 30 Mbs; MAX: 00148111; Type: RS-485 transceiver; Package: Н02.8-1В; PartNumber: 5559ИН28У; HelpURL: https://ic.milandr.ru/products/interfeysnye_mikroskhemy/rs485-rs422/5559in28u/
L1 L2 = Inductor_0603: Manufacturer: ЭРКОН; PartNumber: КИФ1608-1000 нГн ±20% О-А РКМУ.671340.002 ТУ; ValueManufacturerPartNumber: Fixed inductor, 1мк, ±20%, 0603, 400mA, -55...+125°C; TypeInductor: Fixed inductor; MaxCurrent: 400mA; Tolerance: ±20%; R: 0,8 Ом; Package: 0603; HelpURL: https://www.erkon-nn.ru/catalog/14/kif-vp/; Temperature: -55...+125°C
NT1 = NetTie
R27 R31 = Resistor_0603: as R19 on sheet Sheet2; Package: 0603; HelpURL: https://aoresurs.com/catalog/chip_rezistory/rezistory-r1-12-kategoriya-kachestva-vp-/; Temperature: -55...+125°C
R28 = Resistor_0603: Manufacturer: ОАО Ресурс; PartNumber: Р1-12-0,1ум.-680~кОм ±5%-М ШКАБ.434110.002 ТУ; ValueManufacturerPartNumber: Resistor film, 680, ±5%, 0603, 0.1W, -55...+125°C; TypeResistor: Resistor film; Power: 0.1W; Tolerance: ±5%; MAX: 00134086; Package: 0603; HelpURL: https://aoresurs.com/catalog/chip_rezistory/rezistory-r1-12-kategoriya-kachestva-vp-/; Temperature: -55...+125°C
R29 R32 R33 R35 R36 R38-R41 R45 R47 R49 R50 = Resistor_0603: as R11 on sheet Sheet2; Package: 0603; HelpURL: https://aoresurs.com/catalog/chip_rezistory/rezistory-r1-12-kategoriya-kachestva-vp-/; Temperature: -55...+125°C
R30 R34 R37 R42 R44 R46 R48 = Resistor_0603: Manufacturer: ОАО Ресурс; PartNumber: Р1-12-0,1ум.-1~кОм ±1%-М ШКАБ.434110.002 ТУ; ValueManufacturerPartNumber: Resistor film, 1k, ±1%, 0603, 0.1W, -55...+125°C; TypeResistor: Resistor film; Power: 0.1W; Tolerance: ±1%; MAX: 00133971; Package: 0603; HelpURL: https://aoresurs.com/catalog/chip_rezistory/rezistory-r1-12-kategoriya-kachestva-vp-/; Temperature: -55...+125°C
R43 = Resistor_0805: Manufacturer: Русские; PartNumber: Р1-12-0.125-120 Ом±5%-М; ValueManufacturerPartNumber: Resistor film, 120, ±5%, 0805, 0.125W, -55...+125°C; TypeResistor: Resistor film; Power: 0.125W; Tolerance: ±5%; MAX: 00133848; Package: 0805; Temperature: -55...+125°C
VD2 = LED_single: Manufacturer: Протон; ValueManufacturerPartNumber: LED, 20mA max, 1.9V@4mA, 1608, -55...+150°C; TypeDiode: LED; Current: 20mA max; VoltageDrop: 1.9V@4mA; Color: GREEN; Analog: MAX 00129484 КР-1608 Kingbright (pin-to-pin); Package: 1608; HelpURL: *; Temperature: -55...+150°C
VD3 = Diode_array2: Manufacturer: Россия; ValueManufacturerPartNumber: Diode array common anode, 50V, 200mA, 1.1V, , SOT-23,; TypeDiode: Diode array common anode; Voltage: 50V; Current: 200mA; VoltageDrop: 1.1V; MAX: 00122900; Package: SOT-23; HelpURL: https://www.chipdip.ru/product/2d803as9
VT2-VT6 = BJT_NPN_132: as VT1 on sheet Sheet1; Package: SOT-23 (КТ-46); HelpURL: http://www.radioman-portal.ru/sprav/pp/transisters/sourse/2t3130.pdf; Temperature: -55...+125°C
XP3 = PLS2-1: Test probe; PartNumber: СНП377-1ВП21-1; Manufacturer: Электродеталь; Tolerance: СНП377; RefDes/Designator: MAX; Шаг: 2mm; Analog: PLS2-1; MAX: *; Publisher: TEN; Published: 2019; Type: Control pin; HelpURL: https://www.elektrodetal.com/catalog/snp377/
XP4 = M80-5000605 Harwin: вилка на плату; Manufacturer: Электроделать; ValueManufacturerPartNumber: Вилка, 6pin, 2mm, 120VAC, 1.5A; PartNumber: СНП401-6ВП21-3-1-1; VoltageMax: 120VAC; Pitch: 2mm; CurrentMax: 1.5A; Multichannel: 6pin; Analog: MAX 00126397 (M80-5000605 pin-to-pin); HelpURL: https://eu.mouser.com/ProductDetail/Harwin/M80-5000605?qs=yQtJ9TWM%2F1KaJIUUBEXorg%3D%3D; TypeConnector: Вилка
XP5 = M80-5001205 Harwin: вилка на плату; Manufacturer: Электродеталь; ValueManufacturerPartNumber: Вилка, 12pin, 2mm, 100V, 1.5A; PartNumber: СНП401-12ВП21-3-1-1; VoltageMax: 100V; Pitch: 2mm; CurrentMax: 1.5A; Multichannel: 12pin; Analog: MAX 00138662 (M80-5101205 pin-to-pin); HelpURL: https://eu.mouser.com/ProductDetail/Harwin/M80-5001205?qs=yQtJ9TWM%2F1IJJSuF%2FTVm0Q==; TypeConnector: Вилка
XP6 = PLS2-1: Test probe; PartNumber: СНП377-1ВП21-1; Manufacturer: Электродеталь; Tolerance: СНП377; MAX: 00130069; Шаг: 2mm; Analog: PLS2-1; MAX: *; Publisher: TEN; Published: 2019; Type: Control pin; HelpURL: https://www.elektrodetal.com/catalog/snp377/

## Nets that join several sheets
+3.3V(A): Sheet1 (C9.2 DD1.24), Sheet2 (R19.1 R20.1 R25.2 XS1.15), Sheet3 (C24.2 L2.1)
+3.3V(D): Sheet1 (15 pins), Sheet3 (16 pins)
+5V(A): Sheet2 (C11.2 DA1.14), Sheet3 (C17.2 L1.1)
+5V(D): Sheet2 (C10.2 DD2.20 XS1.10 XS1.12), Sheet3 (15 pins)
AGND: Sheet1 (C9.1 DD1.25), Sheet2 (9 pins), Sheet3 (6 pins)
DGND: Sheet1 (19 pins), Sheet2 (14 pins), Sheet3 (35 pins)
5VDC_MOSFET: Sheet2 (DD2.11), Sheet3 (XP5.8)
5VTEST: Sheet1 (DD1.29), Sheet3 (C18.2 R27.2 R31.1)
15VTEST: Sheet1 (DD1.28), Sheet2 (C14.2 R24.2)
ADR0: Sheet1 (DD1.1), Sheet3 (R38.2 VD3.2 XP5.10)
ADR1: Sheet1 (DD1.2), Sheet3 (R39.2 VD3.1 XP5.12)
DC_MOSFET: Sheet1 (DD1.3), Sheet2 (DD2.9 R55.1)
DE (RS): Sheet1 (DD1.48), Sheet3 (DD3.2 DD3.3 R50.1)
DI (RS): Sheet1 (DD1.46), Sheet3 (DD3.4)
HALL_U: Sheet1 (DD1.10), Sheet3 (R29.2 VT2.3)
HALL_V: Sheet1 (DD1.11), Sheet3 (R33.2 VT3.3)
HALL_W: Sheet1 (DD1.12), Sheet3 (R36.2 VT4.3)
IDC: Sheet1 (DD1.26), Sheet2 (C12.1 R18.2 R22.1)
LIMIT_L: Sheet1 (DD1.4), Sheet3 (R41.2 VT5.3)
LIMIT_R: Sheet1 (DD1.5), Sheet3 (R47.2 VT6.3)
PWM_U_HI: Sheet1 (DD1.20), Sheet2 (DD2.4 R13.1)
PWM_U_LO: Sheet1 (DD1.21), Sheet2 (DD2.3 R12.1)
PWM_V_HI: Sheet1 (DD1.16), Sheet2 (DD2.6 R15.1)
PWM_V_LO: Sheet1 (DD1.17), Sheet2 (DD2.5 R14.1)
PWM_W_HI: Sheet1 (DD1.14), Sheet2 (DD2.8 R17.1)
PWM_W_LO: Sheet1 (DD1.15), Sheet2 (DD2.7 R16.1)
RO (RS): Sheet1 (DD1.47), Sheet3 (DD3.1)
SD: Sheet1 (DD1.22), Sheet2 (DD2.2 R11.1)
TZ: Sheet1 (DD1.13), Sheet2 (C32.1 DA1.3 R20.2 R53.2)
UDC: Sheet1 (DD1.27), Sheet2 (C13.2 R21.2)